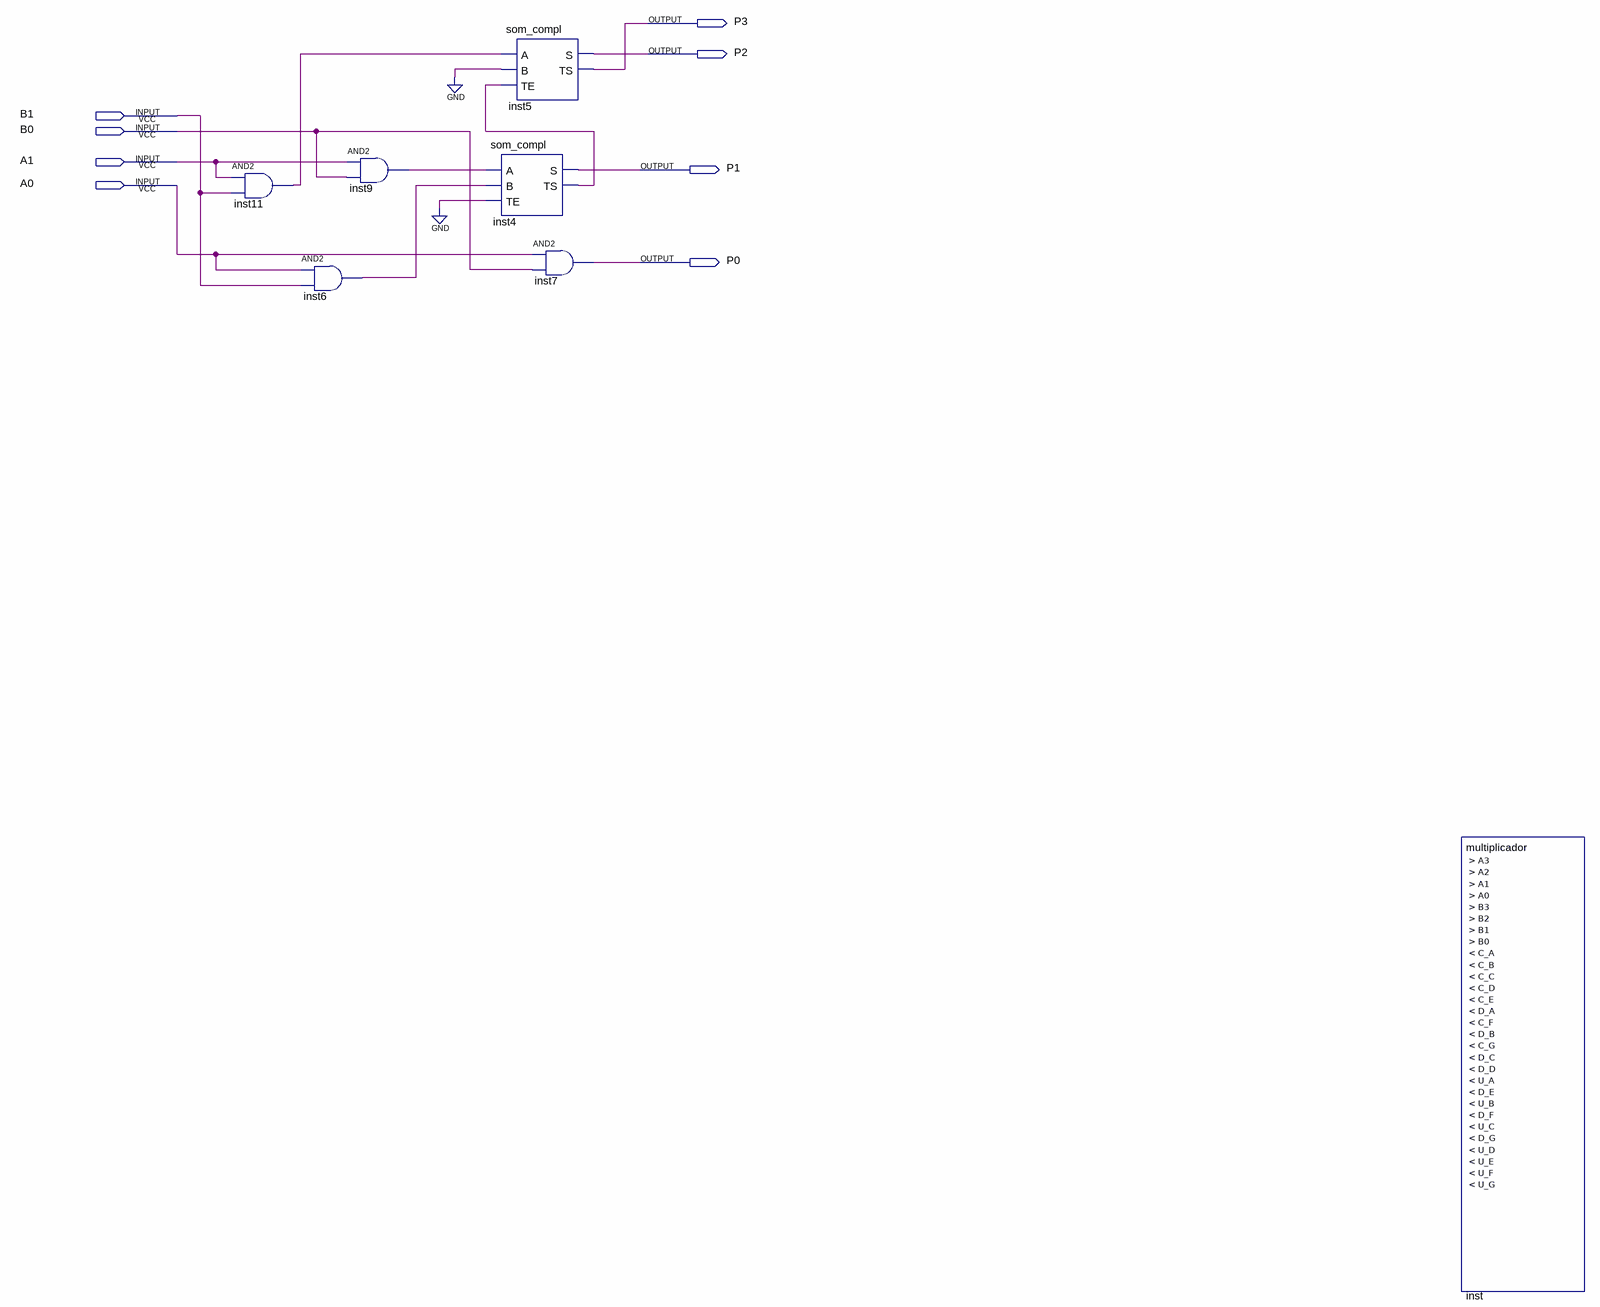
[diagram p0: schematic sheet]
// Quartus schematic bloco_multiplicador_2x2.bdf as structural Verilog: 7 symbols, 8 pins
module bloco_multiplicador_2x2 (
  input  B1,
  input  B0,
  input  A1,
  input  A0,
  output P3,
  output P2,
  output P1,
  output P0
);

  wire inst4_ts, inst6_out, inst9_out, inst11_out;

  and inst11 (inst11_out, A1, B1);
  and inst6 (inst6_out, A0, B1);
  and inst9 (inst9_out, A1, B0);
  som_compl inst5 (.A(inst11_out), .B(1'b0), .TE(inst4_ts), .S(P2), .TS(P3));
  som_compl inst4 (.A(inst9_out), .B(inst6_out), .TE(1'b0), .S(P1), .TS(inst4_ts));
  and inst7 (P0, A0, B0);
  multiplicador inst ();  // open: A3, A2, A1, A0, B3, B2, B1, B0, C_A, C_B, C_C, C_D, C_E, D_A, C_F, D_B, C_G, D_C, D_D, U_A, D_E, U_B, D_F, U_C, D_G, U_D, U_E, U_F, U_G
endmodule
